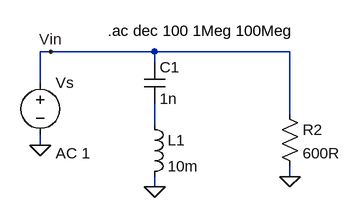
[diagram p0: schematic Compansation Impedance Matching.asc]
Compansation Impedance Matching.asc, the LTspice schematic file:
Version 4
SHEET 1 880 680
WIRE -80 48 -96 48
WIRE 80 48 -80 48
WIRE 288 48 80 48
WIRE 80 64 80 48
WIRE -96 96 -96 48
WIRE 288 144 288 48
WIRE 80 160 80 128
WIRE -96 192 -96 176
WIRE 288 240 288 224
WIRE 80 256 80 240
FLAG 80 256 0
FLAG 288 240 0
FLAG -96 192 0
FLAG -80 48 Vin
SYMBOL cap 64 64 R0
SYMATTR InstName C1
SYMATTR Value 1n
SYMBOL ind 64 144 R0
SYMATTR InstName L1
SYMATTR Value 10m
SYMBOL res 272 128 R0
SYMATTR InstName R2
SYMATTR Value 600R
SYMBOL voltage -96 80 R0
WINDOW 123 24 124 Left 2
WINDOW 39 0 0 Left 0
SYMATTR InstName Vs
SYMATTR Value ""
SYMATTR Value2 AC 1
TEXT 8 16 Left 2 !.ac dec 100 1Meg 100Meg

The netlist it stands for:
* Compansation Impedance Matching.asc
C1 Vin N001 1n
L1 N001 0 10m
R2 Vin 0 600R
Vs Vin 0 AC 1
.ac dec 100 1Meg 100Meg
.backanno
.end